# EAGLE design CAN Star (EAGLE 8.5.0)
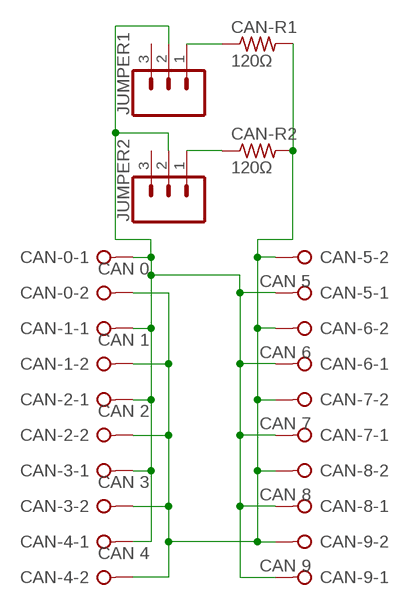
[diagram p0: schematic, sheet 1]

## Parts
CAN-0  CAN 0  W237-02P  [W237-132]
CAN-1  CAN 1  W237-02P  [W237-132]
CAN-2  CAN 2  W237-02P  [W237-132]
CAN-3  CAN 3  W237-02P  [W237-132]
CAN-4  CAN 4  W237-02P  [W237-132]
CAN-5  CAN 5  W237-02P  [W237-132]
CAN-6  CAN 6  W237-02P  [W237-132]
CAN-7  CAN 7  W237-02P  [W237-132]
CAN-8  CAN 8  W237-02P  [W237-132]
CAN-9  CAN 9  W237-02P  [W237-132]
CAN-R1  120Ω  R-US_0207/10  [0207/10]
CAN-R2  120Ω  R-US_0207/10  [0207/10]
JUMPER1  CONN_03  [1X03]
JUMPER2  CONN_03  [1X03]

## Nets
CAN-A: CAN-0.1 CAN-1.1 CAN-2.1 CAN-3.1 CAN-4.1 CAN-5.1 CAN-6.1 CAN-7.1 CAN-8.1 CAN-9.1 JUMPER1.2 JUMPER2.2
CAN-B: CAN-0.2 CAN-1.2 CAN-2.2 CAN-3.2 CAN-4.2 CAN-5.2 CAN-6.2 CAN-7.2 CAN-8.2 CAN-9.2 CAN-R1.2 CAN-R2.2
N$1: CAN-R1.1 JUMPER1.1
N$2: CAN-R2.1 JUMPER2.1
Unconnected: JUMPER1.3 JUMPER2.3

## Library data of the parts
CAN-0 CAN-1-CAN-9 = con-wago-508:W237-02P: WAGO SREW CLAMP; OC_FARNELL: unknown; OC_NEWARK: unknown
CAN-R1 CAN-R2 = resistor:R-US_: RESISTOR, American symbol
JUMPER1 JUMPER2 = SparkFun-Connectors:CONN_03: Multi connection point. Often used as Generic Header-pin footprint for 0.1 inch spaced/style header connections On any of the 0.1 inch spaced packages, you can populate with these: Break Away Headers - Straight <https://www.sparkfun.com/products/116> (PRT-00116) Break Away Male Headers - Right Angle <https://www.sparkfun.com/products/553> (PRT-00553) Female Headers <https://www.sparkfun.com/products/115> (PRT-00115) Break Away Headers - Machine Pin <https://www.sparkfun.com/products/117> (PRT-00117) Break Away Female Headers - Swiss Machine Pin <https://www.sparkfun.com/products/743> (PRT-00743) Stackable Header - 3 Pin (Female, 0.1") <https://www.sparkfun.com/products/13875> (PRT-13875) For SCREWTERMINALS and SPRING TERMINALS visit here: Screw Terimnals on SparkFun.com <https://www.sparkfun.com/search/results?term=Screw+Terminals> (5mm/3.5mm/2.54mm spacing) This device is also useful as a general connection point to wire up your design to another part of your project. Our various solder wires solder well into these plated through hole pads. Hook-Up Wire - Assortment (Stranded, 22 AWG) <https://www.sparkfun.com/products/11375> (PRT-11375) Hook-Up Wire - Assortment (Solid Core, 22 AWG) <https://www.sparkfun.com/products/11367> (PRT-11367) View the entire wire category on our website here <https://www.sparkfun.com/categories/141> Special notes: Molex polarized connector foot print use with SKU : PRT-08232 with associated crimp pins and housings.

## Board
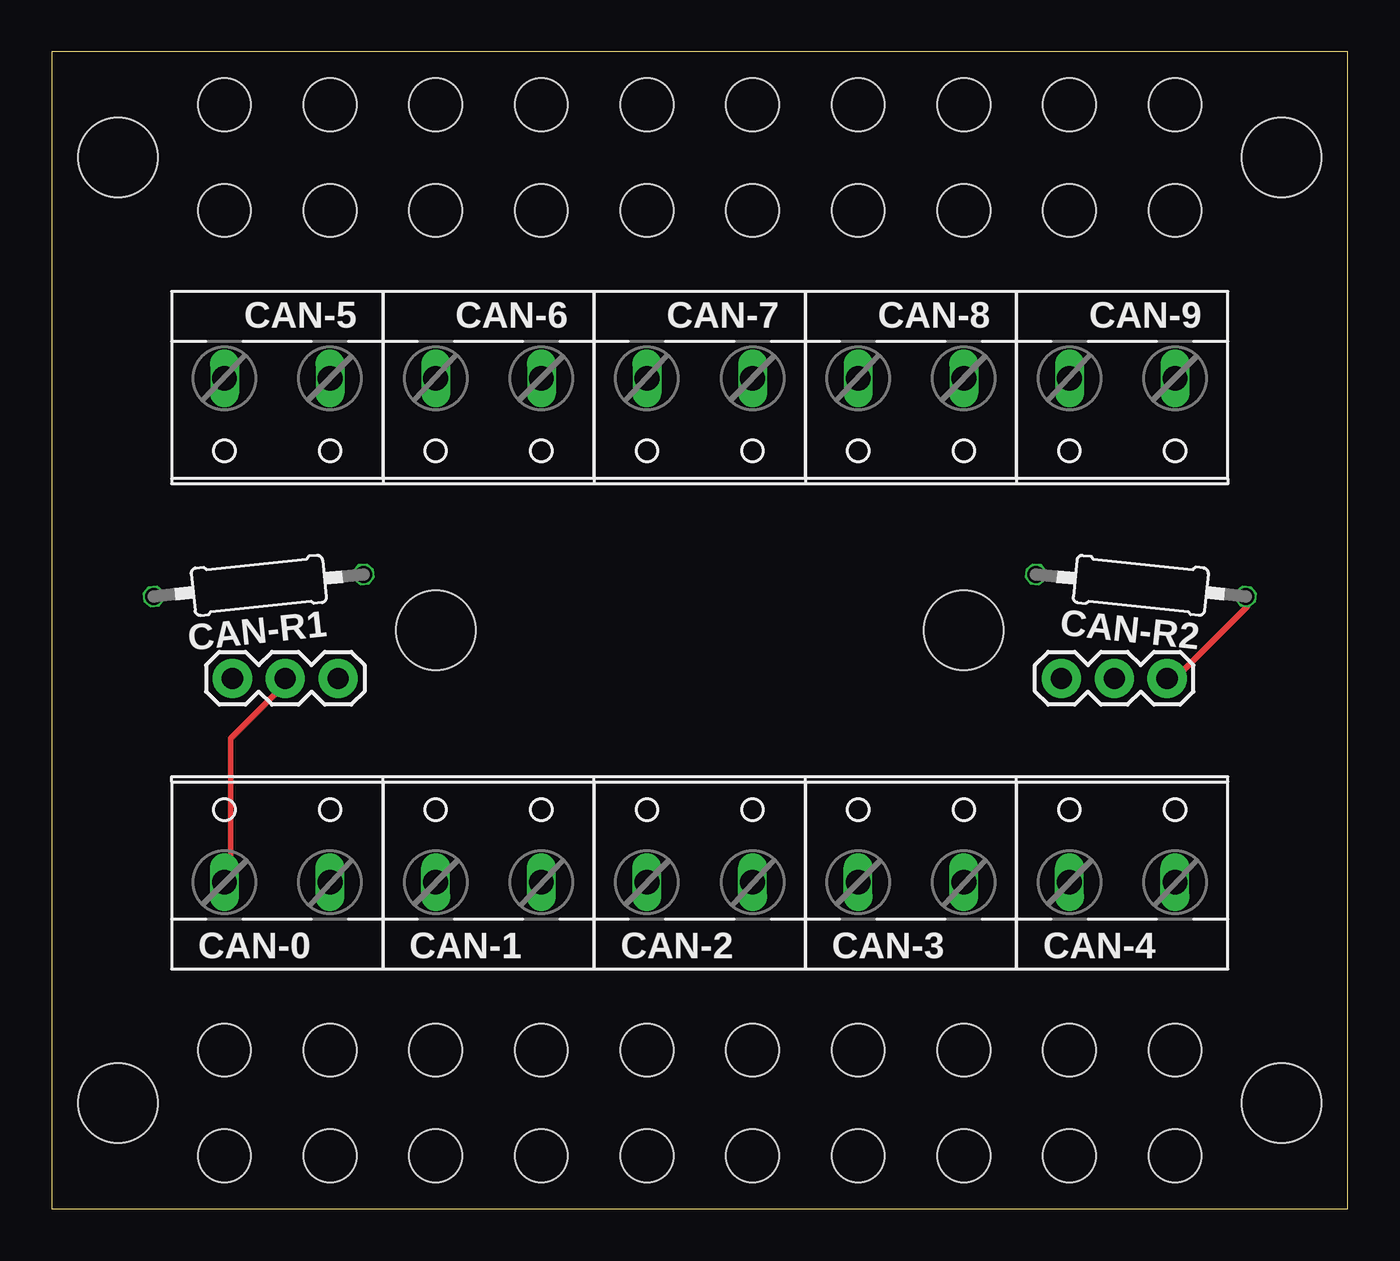
[diagram p1: board, top side]
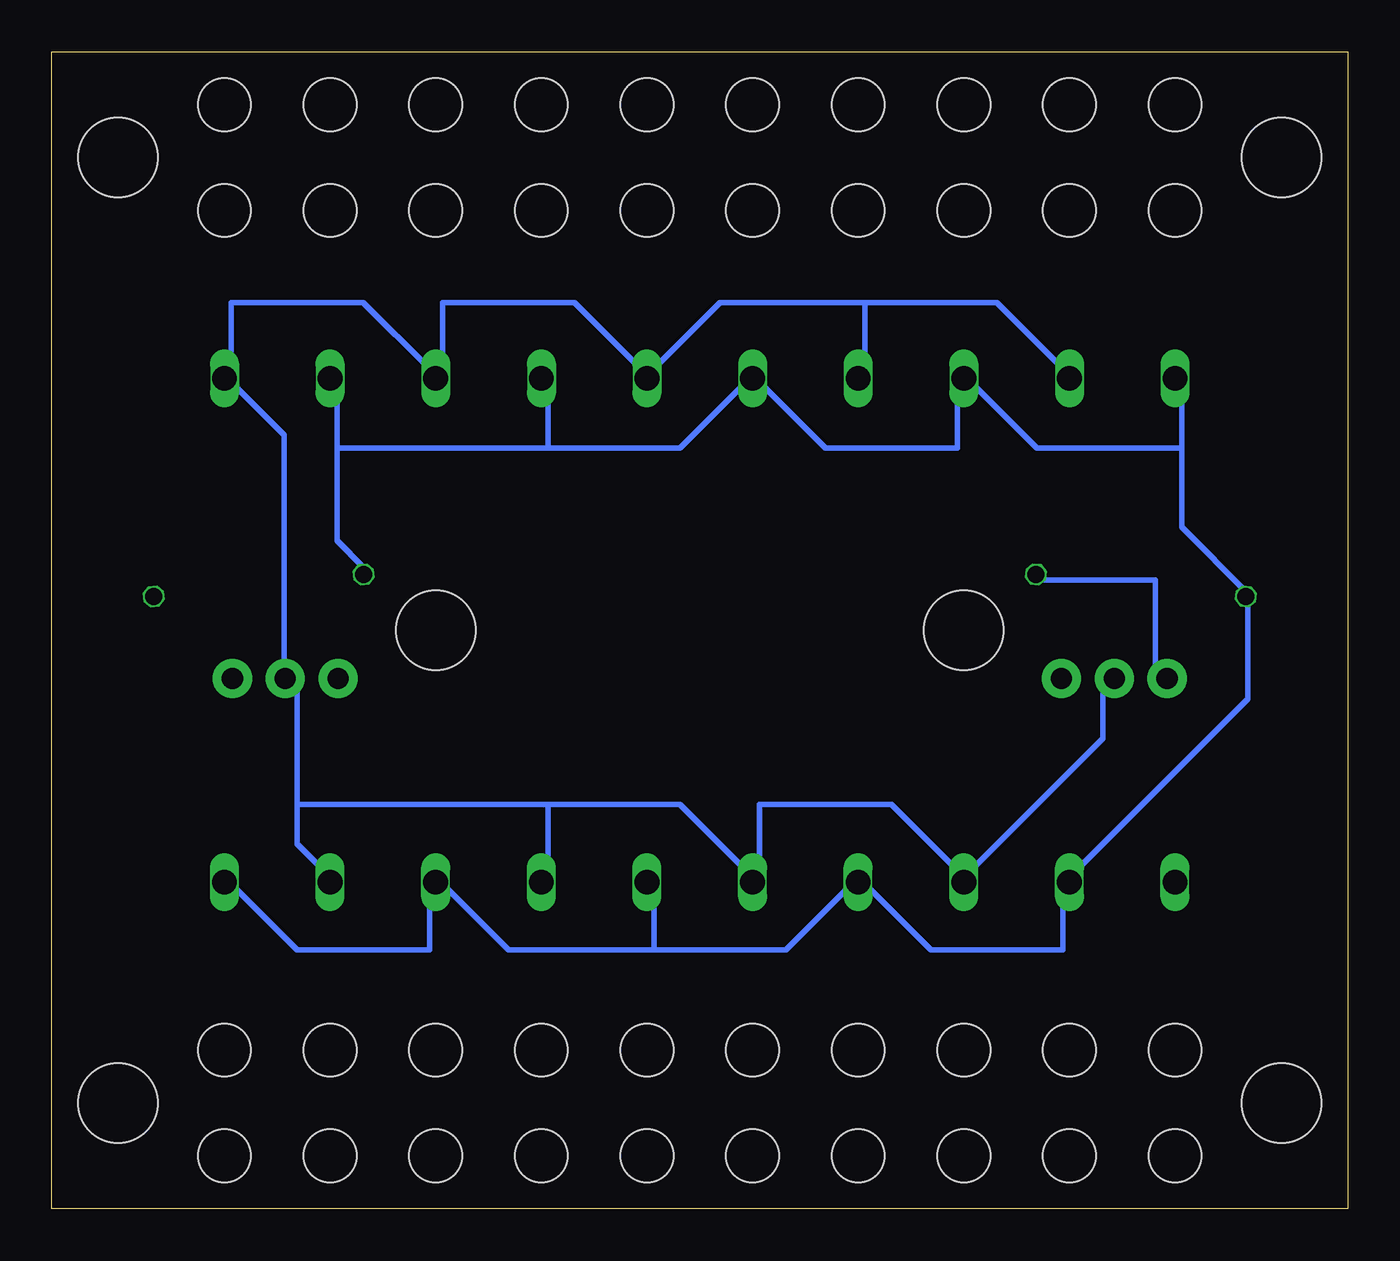
[diagram p2: board, bottom side, seen from below]

Size 62.31 x 55.63 mm. Coordinates in mm from the lower left corner, seen from the top.
Outline: 0,0 62.31,0 62.31,55.63 0,55.63 0,0
Copper layers (1*16): Top 0.0356mm / dielectric 1.5011mm / Bottom 0.0356mm
Design rules "SilverCircuits *": minimum track width 10mil, minimum drill 15mil, track to track 16mil, track to pad 16mil, pad to pad 16mil, via to via 16mil, smd to smd 0mil, copper to edge 20mil, drill to drill 20mil, minimum pad ring 4mil, minimum via ring 8mil, stop-mask expansion 4mil, vias tented up to drill 0mil, thermal gap 10mil
Holes 3.81 mm at 18.45,27.81 43.85,27.81 3.17,50.55 3.17,5.08 59.13,50.55 59.13,5.08
Holes 2.54 mm at 8.29,48.01 8.29,53.09 13.37,53.09 13.37,48.01 18.45,48.01 18.45,53.09 23.53,53.09 23.53,48.01 28.61,48.01 28.61,53.09 33.69,53.09 33.69,48.01 38.77,48.01 38.77,53.09 43.85,53.09 43.85,48.01 48.93,48.01 48.93,53.09 54.01,53.09 54.01,48.01 8.29,2.54 8.29,7.62 13.37,7.62 13.37,2.54 18.45,2.54 18.45,7.62 23.53,7.62 23.53,2.54 28.61,2.54 28.61,7.62 33.69,7.62 33.69,2.54 38.77,2.54 38.77,7.62 43.85,7.62 43.85,2.54 48.93,2.54 48.93,7.62 54.01,7.62 54.01,2.54

### Footprints (pad centres in the part's own frame; a part is rotated, then mirrored left to right if it is on the bottom)
W237-132 = drill 1.194 long: 1 -2.54,-0.635; 2 2.54,-0.635
0207/10 = drill 0.813 octagon: 1 -5.08,0; 2 5.08,0
1X03 = drill 1.016 pad 1.88: 1 0,0; 2 2.54,0; 3 5.08,0

### Placement (x,y rotation side)
CAN-0  10.83,16.33 0 top
CAN-1  20.99,16.33 0 top
CAN-2  31.15,16.33 0 top
CAN-3  41.31,16.33 0 top
CAN-4  51.47,16.33 0 top
CAN-5  10.83,39.29 180 top
CAN-6  20.99,39.29 180 top
CAN-7  31.15,39.29 180 top
CAN-8  41.31,39.29 180 top
CAN-9  51.47,39.29 180 top
CAN-R1  9.95,29.97 186 top
CAN-R2  52.36,29.97 174 top
JUMPER1  8.68,25.5 0 top
JUMPER2  53.63,25.5 180 top

### Tracks (layer width: path | path; a pad name or v marks a point on that pad's centre or on a via)
CAN-A
  Top 0.254: CAN-0.1 8.6,16.26 8.6,22.61 11.14,25.15 JUMPER1.2
  Bottom 0.254: 23.2,43.56 16.85,43.56 13.68,40.39 CAN-5.1 | 23.2,43.56 23.2,40.39 CAN-6.1 | 23.2,43.56 30.19,43.56 33.36,40.39 CAN-7.1 34,40.39 37.17,43.56 43.52,43.56 43.52,40.39 CAN-8.1 44.16,40.39 47.33,43.56 53.68,43.56 53.68,40.39 CAN-9.1 53.68,39.75 51.14,37.21 51.14,25.78 JUMPER2.2 50.51,25.15 50.51,19.43 | JUMPER1.2 11.77,25.15 11.77,22.61 18.12,16.26 CAN-1.1 18.76,16.26 21.93,19.43 28.28,19.43 28.28,16.26 CAN-2.1 28.92,16.26 32.09,19.43 38.44,19.43 | 38.44,19.43 38.44,16.26 CAN-3.1 | 50.51,19.43 50.51,17.53 49.24,16.26 CAN-4.1 | 50.51,19.43 38.44,19.43
CAN-B
  Bottom 0.254: 33.36,12.45 27.01,12.45 23.84,15.62 CAN-1.2 23.2,15.62 20.03,12.45 13.68,12.45 13.68,15.62 CAN-0.2 13.04,16.26 4.79,24.51 4.79,28.96 CAN-R1.2 4.79,29.59 7.96,32.77 7.96,36.58 | 33.36,12.45 33.36,15.62 CAN-2.2 | 33.36,12.45 40.35,12.45 43.52,15.62 CAN-3.2 44.16,15.62 44.16,12.45 50.51,12.45 53.68,15.62 CAN-4.2 | 48.6,36.58 48.6,39.75 CAN-9.2 | 48.6,36.58 48.6,32.13 47.33,30.86 CAN-R2.2 | 38.44,36.58 32.09,36.58 28.92,39.75 CAN-7.2 28.28,39.75 25.11,36.58 18.76,36.58 18.76,39.75 CAN-6.2 18.12,39.75 14.95,36.58 7.96,36.58 | 38.44,36.58 38.44,39.75 CAN-8.2 | 38.44,36.58 48.6,36.58 | 7.96,36.58 7.96,39.75 CAN-5.2
N$1
  Bottom 0.254: CAN-R1.1 14.95,30.23 9.23,30.23 9.23,25.78 JUMPER1.1
N$2
  Top 0.254: CAN-R2.1 57.49,28.96 53.68,25.15 JUMPER2.1

### Text on the board
tValues: Y(H) | G(L) | Y(H) | G(L) | Y(H) | G(L) | Y(H) | G(L) | Y(H) | G(L) | RoboLoCo / Team 5338 | ON | Star Board v5 | ON | G(L) | Y(H) | G(L) | Y(H) | G(L) | Y(H) | G(L) | Y(H) | G(L) | Y(H)